# Altium schematic sheet ADC10080_EVALUATION_BOARD.SchDoc
size A4; SheetNumber: 1; SheetTotal: 1
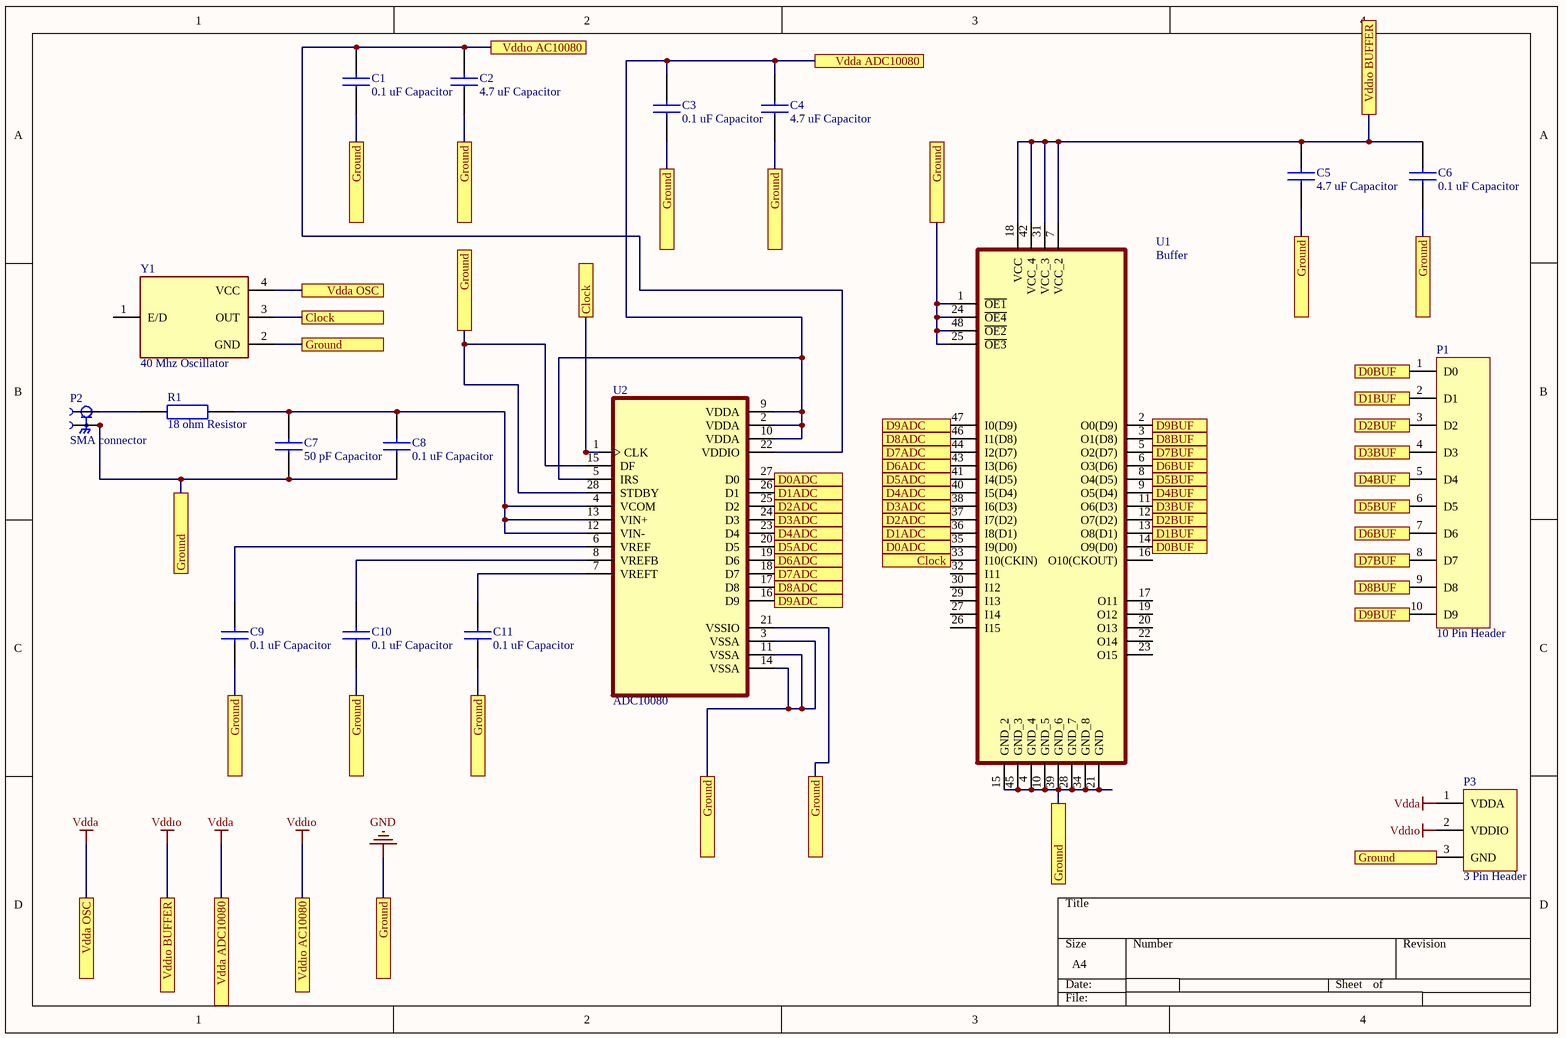
[diagram p0: ADC10080_EVALUATION_BOARD.SchDoc]

## Parts
C1  0.1 uF Capacitor  [C_1206]
C2  4.7 uF Capacitor  [C_1206]
C3  0.1 uF Capacitor  [C_1206]
C4  4.7 uF Capacitor  [C_1206]
C5  4.7 uF Capacitor  [C_1206]
C6  0.1 uF Capacitor  [C_1206]
C7  50 pF Capacitor  [C_1206]
C8  0.1 uF Capacitor  [C_1206]
C9  0.1 uF Capacitor  [C_1206]
C10  0.1 uF Capacitor  [C_1206]
C11  0.1 uF Capacitor  [C_1206]
P1  10 Pin Header  [10 Pin Header]
P2  SMA connector  [SMA CONNECTOR]
P3  3 Pin Header  [3 pin header]
R1  18 ohm Resistor  [R_1206]
U1  Buffer  [74VCX162244MTDX]
U2  ADC10080  [AD10080]
Y1  40 Mhz Oscillator  [CO4305-40.000-EXT-T-TR]

## Ports
Clock, D0ADC, D0BUF, D1ADC, D1BUF, D2ADC, D2BUF, D3ADC, D3BUF, D4ADC, D4BUF, D5ADC, D5BUF, D6ADC, D6BUF, D7ADC, D7BUF, D8ADC, D8BUF, D9ADC, D9BUF, Ground, Vdda ADC10080, Vdda OSC, Vddıo AC10080, Vddıo BUFFER

## Nets
GND: C1.1 C2.1 C3.1 C4.1 C5.1 C6.1 C7.1 C8.1 C9.1 C10.1 C11.1 P2.S1 P2.S2 P2.S3 P2.S4 P3.3(GND) U1.1(~{OE1}) U1.4(GND_4) U1.10(GND_5) U1.15(GND_2) U1.21(GND) U1.24(~{OE4}) U1.25(~{OE3}) U1.28(GND_7) U1.34(GND_8) U1.39(GND_6) U1.45(GND_3) U1.48(~{OE2}) U2.3(VSSA) U2.11(VSSA) U2.14(VSSA) U2.15(DF) U2.21(VSSIO) U2.28(STDBY) Y1.2(GND) ; port Ground
Vdda: C3.2 C4.2 P3.1(VDDA) U2.2(VDDA) U2.5(IRS) U2.9(VDDA) U2.10(VDDA) Y1.4(VCC) ; port Vdda OSC, port Vdda ADC10080
Vddıo: C1.2 C2.2 C5.2 C6.2 P3.2(VDDIO) U1.7(VCC_2) U1.18(VCC) U1.31(VCC_3) U1.42(VCC_4) U2.22(VDDIO) ; port Vddıo BUFFER, port Vddıo AC10080
Clock: U1.33(I10(CKIN)) U2.1(CLK) Y1.3(OUT) ; port Clock
D0ADC: U1.35(I9(D0)) U2.27(D0) ; port D0ADC
D0BUF: P1.1(D0) U1.14(O9(D0)) ; port D0BUF
D1ADC: U1.36(I8(D1)) U2.26(D1) ; port D1ADC
D1BUF: P1.2(D1) U1.13(O8(D1)) ; port D1BUF
D2ADC: U1.37(I7(D2)) U2.25(D2) ; port D2ADC
D2BUF: P1.3(D2) U1.12(O7(D2)) ; port D2BUF
D3ADC: U1.38(I6(D3)) U2.24(D3) ; port D3ADC
D3BUF: P1.4(D3) U1.11(O6(D3)) ; port D3BUF
D4ADC: U1.40(I5(D4)) U2.23(D4) ; port D4ADC
D4BUF: P1.5(D4) U1.9(O5(D4)) ; port D4BUF
D5ADC: U1.41(I4(D5)) U2.20(D5) ; port D5ADC
D5BUF: P1.6(D5) U1.8(O4(D5)) ; port D5BUF
D6ADC: U1.43(I3(D6)) U2.19(D6) ; port D6ADC
D6BUF: P1.7(D6) U1.6(O3(D6)) ; port D6BUF
D7ADC: U1.44(I2(D7)) U2.18(D7) ; port D7ADC
D7BUF: P1.8(D7) U1.5(O2(D7)) ; port D7BUF
D8ADC: U1.46(I1(D8)) U2.17(D8) ; port D8ADC
D8BUF: P1.9(D8) U1.3(O1(D8)) ; port D8BUF
D9ADC: U1.47(I0(D9)) U2.16(D9) ; port D9ADC
D9BUF: P1.10(D9) U1.2(O0(D9)) ; port D9BUF
NetC7_2: C7.2 C8.2 R1.2 U2.4(VCOM) U2.12(VIN-) U2.13(VIN+)
NetC9_2: C9.2 U2.6(VREF)
NetC10_2: C10.2 U2.8(VREFB)
NetC11_2: C11.2 U2.7(VREFT)
NetP2_1: P2.1 R1.1

Not connected (* = marked no-connect by the designer): U1 16(O10(CKOUT)) 17(O11) 19(O12) 20(O13) 22(O14) 23(O15) 26(I15) 27(I14) 29(I13) 30(I12) 32(I11); Y1 1(E/D)

## Library data of the parts
C1 C3 C6 C8-C11 = C_0.1uF_1206: 0.1 uF 1206 Capacitor
C2 C4 C5 = C_4.7uF_1206: 4.7 uF 1206 Capacitor
C7 = C_50pF_1206: 50 pF 1206 Capacitor
P1 = 10 Pin Header: 10 Pin Output Header
P3 = 3 pin header: 3 Pin Voltage Supply Header
R1 = R_18_1206: 18 ohm 1206 Resistor
U1 = 74VCX162244MTDX: Low Voltage 16-Bit Buffer/Line Driver / with 3.6V Tolerant Inputs and Outputs / and 26 Series Resistor in Outputs
U2 = ADC10080: ADC10080 10-Bit, 80 MSPS, 3V, 78.6 mW A/D Converter
Y1 = CO4305-40.000-EXT-T-TR: 40 Mhz 4 pin crystal oscillator